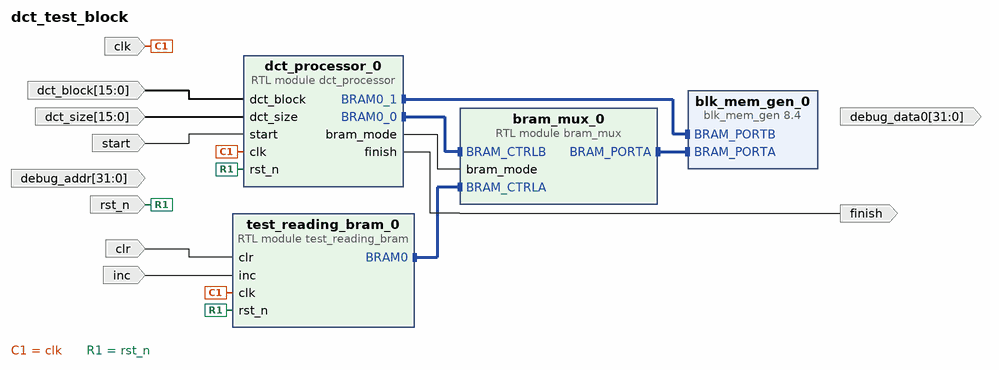
[diagram p0: block diagram of the top level]
# Vivado block design dct_test_block, xck26-sfvc784-2LV-c, Vivado 2023.1.1
create_bd_design dct_test_block

create_bd_port -dir O finish
create_bd_port -dir I -type clk clk
create_bd_port -dir I -type rst rst_n
create_bd_port -dir I start
create_bd_port -dir I -from 15 -to 0 dct_block
create_bd_port -dir I -from 15 -to 0 dct_size
create_bd_port -dir I inc
create_bd_port -dir I clr
create_bd_port -dir I -from 31 -to 0 debug_addr
create_bd_port -dir O -from 31 -to 0 debug_data0

create_bd_cell -type ip -vlnv xilinx.com:ip:blk_mem_gen:8.4 blk_mem_gen_0
set_property -dict [list \
  CONFIG.Coe_File ../../../../ip/dct_test.coe \
  CONFIG.Enable_32bit_Address true \
  CONFIG.Fill_Remaining_Memory_Locations true \
  CONFIG.Load_Init_File true \
  CONFIG.Memory_Type True_Dual_Port_RAM \
  CONFIG.Register_PortA_Output_of_Memory_Primitives false \
  CONFIG.Register_PortB_Output_of_Memory_Primitives false \
  CONFIG.Write_Width_A 32 \
  CONFIG.use_bram_block Stand_Alone \
] [get_bd_cells blk_mem_gen_0]
create_bd_cell -type module -reference test_reading_bram test_reading_bram_0
create_bd_cell -type module -reference dct_processor dct_processor_0
create_bd_cell -type module -reference bram_mux bram_mux_0

# ---- connections ----

connect_bd_intf_net [get_bd_intf_pins bram_mux_0/BRAM_PORTA] [get_bd_intf_pins blk_mem_gen_0/BRAM_PORTA]
connect_bd_intf_net [get_bd_intf_pins bram_mux_0/BRAM_CTRLB] [get_bd_intf_pins dct_processor_0/BRAM0_0]
connect_bd_intf_net [get_bd_intf_pins dct_processor_0/BRAM0_1] [get_bd_intf_pins blk_mem_gen_0/BRAM_PORTB]
connect_bd_intf_net [get_bd_intf_pins test_reading_bram_0/BRAM0] [get_bd_intf_pins bram_mux_0/BRAM_CTRLA]
connect_bd_net -net clk_0_1 [get_bd_ports clk] [get_bd_pins test_reading_bram_0/clk] [get_bd_pins dct_processor_0/clk]
connect_bd_net -net clr_0_1 [get_bd_ports clr] [get_bd_pins test_reading_bram_0/clr]
connect_bd_net -net dct_block_0_1 [get_bd_ports dct_block] [get_bd_pins dct_processor_0/dct_block]
connect_bd_net [get_bd_pins dct_processor_0/bram_mode] [get_bd_pins bram_mux_0/bram_mode]
# net dct_processor_0_debug_data0 has one end: debug_data0
connect_bd_net [get_bd_pins dct_processor_0/finish] [get_bd_ports finish]
connect_bd_net -net dct_size_0_1 [get_bd_ports dct_size] [get_bd_pins dct_processor_0/dct_size]
# net debug_addr_0_1 has one end: debug_addr
connect_bd_net -net inc_0_1 [get_bd_ports inc] [get_bd_pins test_reading_bram_0/inc]
connect_bd_net -net rst_n_0_1 [get_bd_ports rst_n] [get_bd_pins test_reading_bram_0/rst_n] [get_bd_pins dct_processor_0/rst_n]
connect_bd_net -net start_0_1 [get_bd_ports start] [get_bd_pins dct_processor_0/start]

validate_bd_design
save_bd_design
